# Altium schematic sheet Analog_Circuit.SchDoc
size A4; SheetNumber: 3; SheetTotal: 4
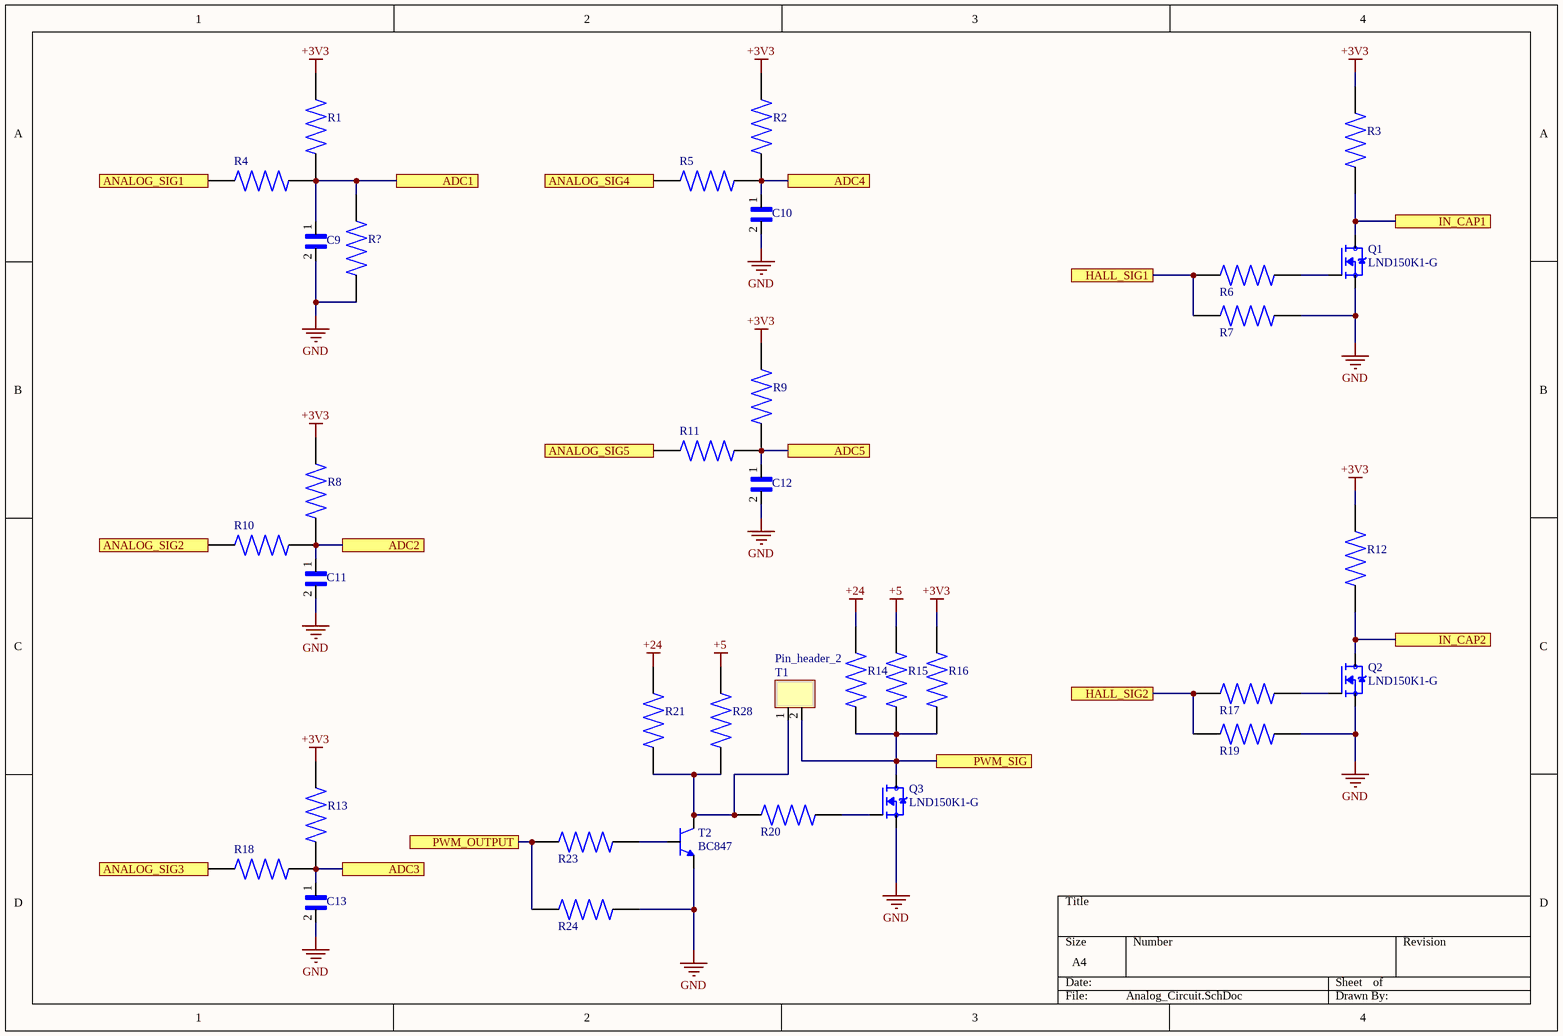
[diagram p0: Analog_Circuit.SchDoc]

## Parts
C9  0805_Capacitor  [0805_Capacitor]  (value not drawn)
C10  0805_Capacitor  [0805_Capacitor]  (value not drawn)
C11  0805_Capacitor  [0805_Capacitor]  (value not drawn)
C12  0805_Capacitor  [0805_Capacitor]  (value not drawn)
C13  0805_Capacitor  [0805_Capacitor]  (value not drawn)
Q1  LND150K1-G  [SOT93-NMOS]
Q2  LND150K1-G  [SOT93-NMOS]
Q3  LND150K1-G  [SOT93-NMOS]
R1  0805_Resistor  [0805_Resistor]  (value not drawn)
R2  0805_Resistor  [0805_Resistor]  (value not drawn)
R3  0805_Resistor  [0805_Resistor]  (value not drawn)
R4  0805_Resistor  [0805_Resistor]  (value not drawn)
R5  0805_Resistor  [0805_Resistor]  (value not drawn)
R6  0805_Resistor  [0805_Resistor]  (value not drawn)
R7  0805_Resistor  [0805_Resistor]  (value not drawn)
R8  0805_Resistor  [0805_Resistor]  (value not drawn)
R9  0805_Resistor  [0805_Resistor]  (value not drawn)
R10  0805_Resistor  [0805_Resistor]  (value not drawn)
R11  0805_Resistor  [0805_Resistor]  (value not drawn)
R12  0805_Resistor  [0805_Resistor]  (value not drawn)
R13  0805_Resistor  [0805_Resistor]  (value not drawn)
R14  0805_Resistor  [0805_Resistor]  (value not drawn)
R15  0805_Resistor  [0805_Resistor]  (value not drawn)
R16  0805_Resistor  [0805_Resistor]  (value not drawn)
R17  0805_Resistor  [0805_Resistor]  (value not drawn)
R18  0805_Resistor  [0805_Resistor]  (value not drawn)
R19  0805_Resistor  [0805_Resistor]  (value not drawn)
R20  0805_Resistor  [0805_Resistor]  (value not drawn)
R21  0805_Resistor  [0805_Resistor]  (value not drawn)
R23  0805_Resistor  [0805_Resistor]  (value not drawn)
R24  0805_Resistor  [0805_Resistor]  (value not drawn)
R28  0805_Resistor  [0805_Resistor]  (value not drawn)
R?  0805_Resistor  [0805_Resistor]  (value not drawn)
T1  Pin_header_2  [Pin_header_2]
T2  BC847  [SOT23]

## Ports
ADC1 (see Dynamics_Sch[6B]), ADC2 (see Dynamics_Sch[6B]), ADC3 (see Dynamics_Sch[6B]), ADC4 (see Dynamics_Sch[6B]), ADC5 (see Dynamics_Sch[6B]), ANALOG_SIG1 (see Dynamics_Sch[1B]), ANALOG_SIG2 (see Dynamics_Sch[1B]), ANALOG_SIG3 (see Dynamics_Sch[1B]), ANALOG_SIG4 (see Dynamics_Sch[1B]), ANALOG_SIG5 (see Dynamics_Sch[1B]), HALL_SIG1 (see Dynamics_Sch[1B]), HALL_SIG2 (see Dynamics_Sch[1B]), IN_CAP1 (see Dynamics_Sch[6B]), IN_CAP2 (see Dynamics_Sch[6B]), PWM_OUTPUT (see Dynamics_Sch[7B]), PWM_SIG (see Dynamics_Sch[2B])

## Nets
+3V3: R1.2 R2.2 R3.1 R8.2 R9.2 R12.1 R13.2 R16.1
+5: R15.1 R28.1
+24: R14.1 R21.2
GND: C9.2 C10.2 C11.2 C12.2 C13.2 Q1.3(S) Q2.3(S) Q3.3(S) R7.2 R19.2 R24.1 R?.1 T2.2(E)
ADC1: C9.1 R1.1 R4.2 R?.2 ; port ADC1
ADC2: C11.1 R8.1 R10.2 ; port ADC2
ADC3: C13.1 R13.1 R18.2 ; port ADC3
ADC4: C10.1 R2.1 R5.2 ; port ADC4
ADC5: C12.1 R9.1 R11.2 ; port ADC5
ANALOG_SIG1: R4.1 ; port ANALOG_SIG1
ANALOG_SIG2: R10.1 ; port ANALOG_SIG2
ANALOG_SIG3: R18.1 ; port ANALOG_SIG3
ANALOG_SIG4: R5.1 ; port ANALOG_SIG4
ANALOG_SIG5: R11.1 ; port ANALOG_SIG5
HALL_SIG1: R6.2 R7.1 ; port HALL_SIG1
HALL_SIG2: R17.2 R19.1 ; port HALL_SIG2
IN_CAP1: Q1.2(D) R3.2 ; port IN_CAP1
IN_CAP2: Q2.2(D) R12.2 ; port IN_CAP2
PWM_OUTPUT: R23.2 R24.2 ; port PWM_OUTPUT
PWM_SIG: Q3.2(D) R14.2 R15.2 R16.2 T1.2 ; port PWM_SIG
NetQ1_1: Q1.1(G) R6.1
NetQ2_1: Q2.1(G) R17.1
NetQ3_1: Q3.1(G) R20.1
NetR20_2: R20.2 R21.1 R28.2 T1.1 T2.3(C)
NetR23_1: R23.1 T2.1(B)

## Library data of the parts
C9-C13 = 0805_Capacitor: MP: CL21B104KBCNNNC; MF: Samsung; Availability: Unavailable; Package: 0805 Samsung; Value: *; Price: None; SnapEDA_Link: https://www.snapeda.com/parts/CL21B104KBCNNNC/Samsung/view-part/3597943/?ref=snap
Q1-Q3 = LND150K1-G: MOSFET, DEPLETION-MODE, 500V, 1K Ohm3 SOT-23 T/R | Microchip Technology Inc. LND150K1-G; SnapEDA_Link: https://www.snapeda.com/parts/LND150K1-G/Microchip/view-part/?ref=snap; Package: SOT-23 Microchip; Value: *; MF: Microchip; MP: LND150K1-G; Check_prices: https://www.snapeda.com/parts/LND150K1-G/Microchip/view-part/?ref=eda
R1-R21 R23 R24 R28 R? = 0805_Resistor: MF: Yageo; MP: RC0805FR-07910RL; Package: 2012 Rohm Semiconductor; Value: *; Purchase-URL: https://pricing.snapeda.com/search/part/RC0805FR-07910RL/?ref=eda; Availability: In Stock; Price: None
T2 = BC847: <b>NPN TRANSISTOR</b>; Availability: Unavailable; Package: None; MP: BC847; Value: *; Price: None